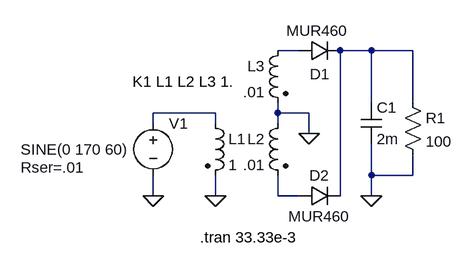
[diagram p0: schematic FWrecFiltt.asc]
FWrecFiltt.asc, the LTspice schematic file:
Version 4
SHEET 1 880 680
WIRE 208 64 176 64
WIRE 320 64 272 64
WIRE 384 64 320 64
WIRE 320 144 320 64
WIRE 384 144 384 64
WIRE 80 160 -16 160
WIRE 176 160 176 144
WIRE 224 160 176 160
WIRE -16 176 -16 160
WIRE 80 176 80 160
WIRE 176 176 176 160
WIRE 224 192 224 160
WIRE 320 256 320 208
WIRE 384 256 384 224
WIRE 384 256 320 256
WIRE -16 288 -16 256
WIRE 80 288 80 256
WIRE 176 288 176 256
WIRE 208 288 176 288
WIRE 272 288 272 64
WIRE 320 288 320 256
FLAG -16 288 0
FLAG 80 288 0
FLAG 320 288 0
FLAG 224 192 0
SYMBOL voltage -16 160 R0
WINDOW 3 -204 56 Left 0
WINDOW 123 0 0 Left 0
WINDOW 39 -204 84 Left 0
SYMATTR Value SINE(0 170 60)
SYMATTR SpiceLine Rser=.01
SYMATTR InstName V1
SYMBOL ind2 64 160 R0
SYMATTR InstName L1
SYMATTR Value 1
SYMATTR Type ind
SYMBOL ind2 192 160 M0
SYMATTR InstName L2
SYMATTR Value .01
SYMATTR Type ind
SYMBOL res 368 128 R0
SYMATTR InstName R1
SYMATTR Value 100
SYMBOL diode 208 48 M90
WINDOW 0 68 33 VBottom 0
WINDOW 3 -30 29 VTop 0
SYMATTR InstName D1
SYMATTR Value MUR460
SYMBOL cap 304 144 R0
SYMATTR InstName C1
SYMATTR Value 2m
SYMBOL ind2 192 48 M0
SYMATTR InstName L3
SYMATTR Value .01
SYMATTR Type ind
SYMBOL diode 208 304 R270
WINDOW 0 32 32 VTop 0
WINDOW 3 0 32 VBottom 0
SYMATTR InstName D2
SYMATTR Value MUR460
TEXT 56 352 Left 0 !.tran 33.33e-3
TEXT -48 112 Left 0 !K1 L1 L2 L3 1.

The netlist it stands for:
* FWrecFiltt.asc
V1 N003 0 SINE(0 170 60) Rser=.01
L1 N003 0 1
L2 0 N004 .01
R1 N002 0 100
D1 N001 N002 MUR460
C1 N002 0 2m
L3 N001 0 .01
D2 N004 N002 MUR460
.model D D
.lib standard.dio
.tran 33.33e-3
K1 L1 L2 L3 1.
.backanno
.end